# EasyEDA Pro project ProPrj_Solar MPPT Charger v6_2026-05-25.epro

# Schematic Solar Converter
Board Name: Solar Converter; Create Date: 2025-08-21; Page Name: Solar Converter; Project Name: Solar MPPT Charger v6; Schematic Name: Solar Converter; Update Date: 2025-08-22; Add into BOM: yes; Company: Your Company; Convert to PCB: yes; Date: 2020-07-08; Draw By: iqasi096; REV: 1.0; Sheet: 1/1
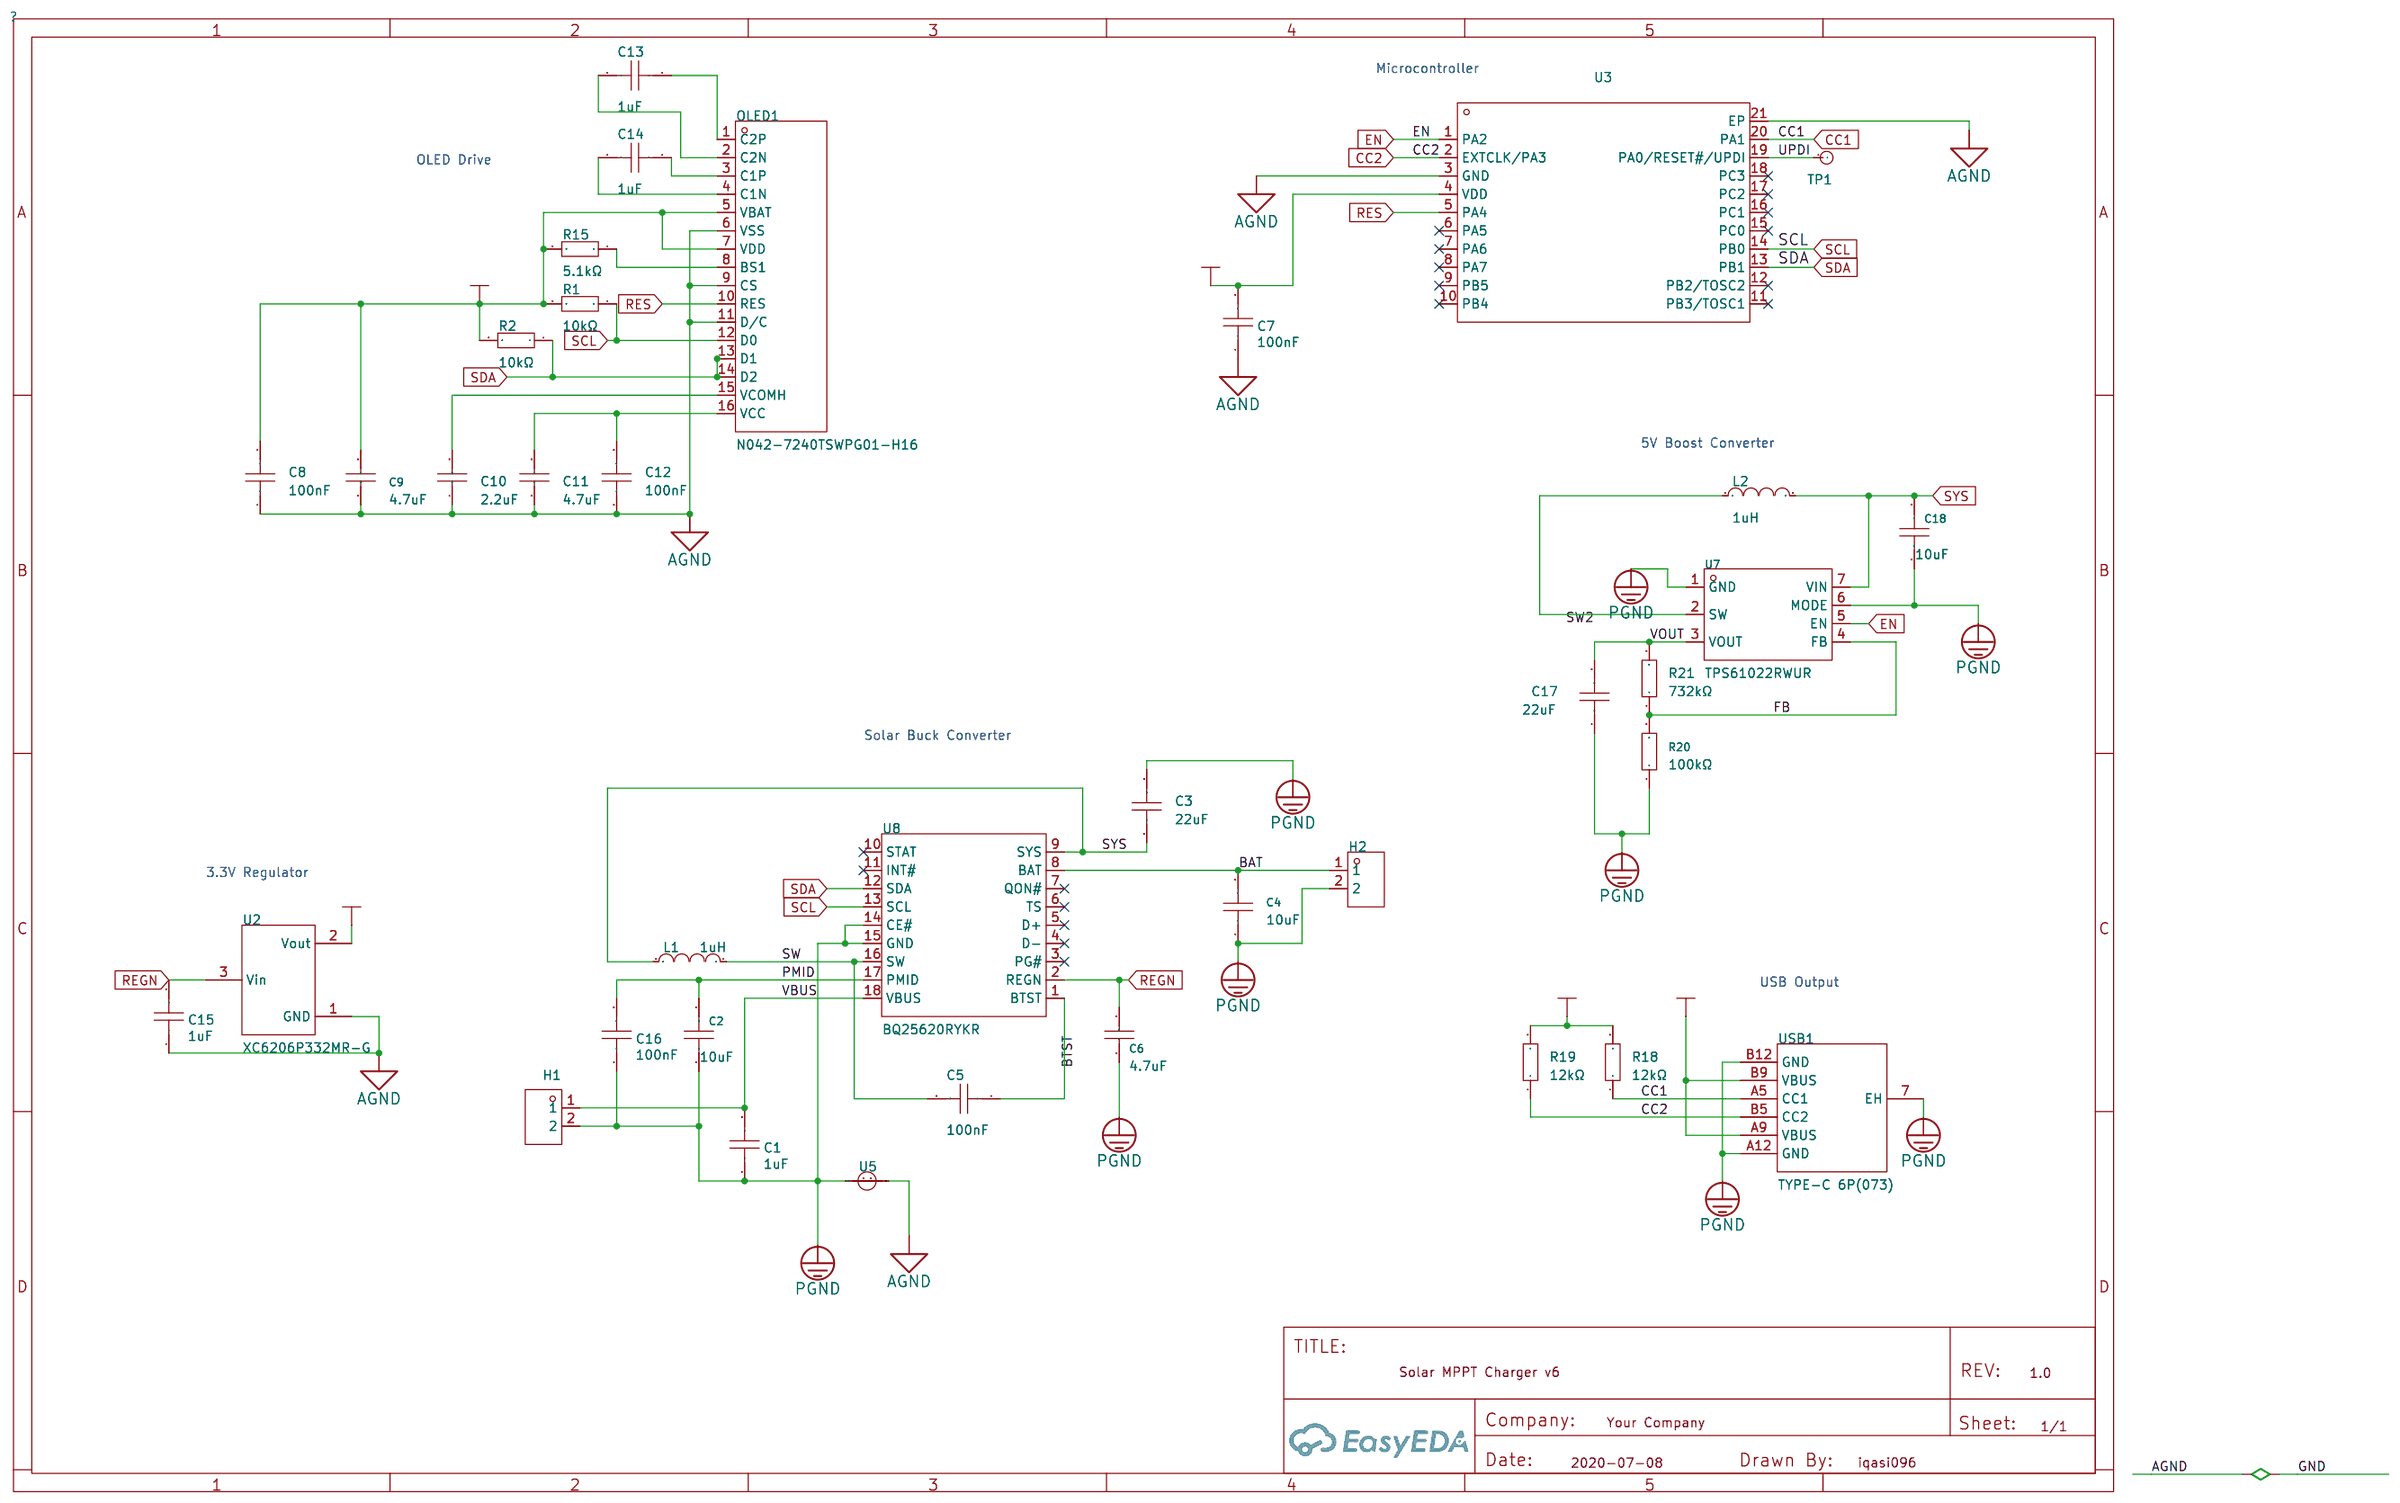
[diagram p0: schematic sheet]

## Parts
C1  1uF  [C0402]
C2  10uF  [C0603]
C3  22uF  [C0805]
C4  10uF  [C0603]
C5  100nF  [C0402]
C6  4.7uF  [C0402]
C7  100nF  [C0402]
C8  100nF  [C0402]
C9  4.7uF  [C0402]
C10  2.2uF  [C0603]
C11  4.7uF  [C0603]
C12  100nF  [C0402]
C13  1uF  [C0402]
C14  1uF  [C0402]
C15  1uF  [C0402]
C16  100nF  [C0402]
C17  22uF  [C0805]
C18  10uF  [C0603]
H1  SIP2-2.54MM双排针  [footprint_31f8]
H2  SIP2-2.54MM双排针  [footprint_31f8]
L1  1uH  [IND-SMD_L5.4-W5.2_SUMIDA_0530CDMCCDS]
L2  1uH  [IND-SMD_L5.4-W5.2_SUMIDA_0530CDMCCDS]
OLED1  N042-7240TSWPG01-H16  [OLED-SMD_L23.0-W12.0_N042-7240TSWPG01-H16]
R1  10kΩ  [R0402]
R2  10kΩ  [R0402]
R15  5.1kΩ  [R0402]
R18  12kΩ  [R0402]
R19  12kΩ  [R0402]
R20  100kΩ  [R0402]
R21  732kΩ  [R0402]
TP1  TESTPOIN-SMD-Ø1.2MM  [footprint_b741]
U2  XC6206P332MR-G  [SOT-23-3_L2.9-W1.6-P1.90-LS2.8-BR]
U3  ATTINY1616-MNR  [footprint_6c4b]
U5  -  [short_keith]  (no BOM)
U7  TPS61022RWUR  [VQFN-7_L2.0-W2.0-P0.55-TL_RWU]
U8  BQ25620RYKR  [WQFN-18_L3.0-W2.5-P0.40-TL]
USB1  TYPE-C 6P(073)  [TYPE-C-SMD_TYPE-C-6P-073]

## Library data of the parts
C1 C13-C15 = CL05A105KA5NQNC: Capacitance: Tolerance:±10% Tolerance:±10% Voltage Rated: Temperature Coefficient:; LCSC Part Name: 1uF ±10% 25V; Supplier Part: C52923; Manufacturer: SAMSUNG(三星); Supplier Footprint: 0402; JLCPCB Part Class: Basic Part; Datasheet: https://atta.szlcsc.com/upload/public/pdf/source/20160218/1457707763339.pdf; Supplier: LCSC; Tolerance: ±10%
C2 C4 C18 = CL10A106MA8NRNC: Capacitance: Tolerance:±20% Tolerance:±20% Voltage Rated: Temperature Coefficient:; LCSC Part Name: 10uF ±20% 25V; Supplier Part: C96446; Manufacturer: SAMSUNG(三星); Supplier Footprint: 0603; JLCPCB Part Class: Basic Part; Datasheet: https://atta.szlcsc.com/upload/public/pdf/source/20160218/1457707763339.pdf; Supplier: LCSC; Tolerance: ±20%
C3 C17 = CL21A226MAQNNNE: Capacitance: Tolerance:±20% Tolerance:±20% Voltage Rated: Temperature Coefficient:; LCSC Part Name: 22uF ±20% 25V; Supplier Part: C45783; Manufacturer: SAMSUNG(三星); Supplier Footprint: 0805; JLCPCB Part Class: Basic Part; Datasheet: https://atta.szlcsc.com/upload/public/pdf/source/20160218/1457707763339.pdf; Supplier: LCSC; Tolerance: ±20%
C5 = CL05B104KO5NNNC: Capacitance: Tolerance:±10% Tolerance:±10% Voltage Rated: Temperature Coefficient:; LCSC Part Name: 100nF ±10% 16V; Supplier Part: C1525; Manufacturer: SAMSUNG(三星); Supplier Footprint: 0402; JLCPCB Part Class: Basic Part; Datasheet: https://atta.szlcsc.com/upload/public/pdf/source/20160218/1457707763339.pdf; Supplier: LCSC; Tolerance: ±10%
C6 C9 = CL05A475MP5NRNC: Capacitance: Tolerance:±20% Tolerance:±20% Voltage Rated: Temperature Coefficient:; LCSC Part Name: 4.7uF ±20% 10V; Supplier Part: C23733; Manufacturer: SAMSUNG(三星); Supplier Footprint: 0402; JLCPCB Part Class: Basic Part; Datasheet: https://atta.szlcsc.com/upload/public/pdf/source/20160218/1457707763339.pdf; Supplier: LCSC; Tolerance: ±20%
C7 C8 C12 C16 = CL05B104KB54PNC: Capacitance: Tolerance:±10% Tolerance:±10% Voltage Rated: Temperature Coefficient:; LCSC Part Name: 100nF ±10% 50V; Supplier Part: C307331; Manufacturer: SAMSUNG(三星); Supplier Footprint: 0402; JLCPCB Part Class: Basic Part; Datasheet: https://atta.szlcsc.com/upload/public/pdf/source/20160218/1457707763339.pdf; Supplier: LCSC; Tolerance: ±10%
C10 = CL10A225KO8NNNC: Capacitance: Tolerance:±10% Tolerance:±10% Voltage Rated: Temperature Coefficient:; LCSC Part Name: 2.2uF ±10% 16V; Supplier Part: C23630; Manufacturer: SAMSUNG(三星); Supplier Footprint: 0603; JLCPCB Part Class: Basic Part; Datasheet: https://atta.szlcsc.com/upload/public/pdf/source/20160218/1457707763339.pdf; Supplier: LCSC; Tolerance: ±10%
C11 = CL10A475KO8NNNC: Capacitance: Tolerance:±10% Tolerance:±10% Voltage Rated: Temperature Coefficient:; LCSC Part Name: 4.7uF ±10% 16V; Supplier Part: C19666; Manufacturer: SAMSUNG(三星); Supplier Footprint: 0603; JLCPCB Part Class: Basic Part; Datasheet: https://atta.szlcsc.com/upload/public/pdf/source/20160218/1457707763339.pdf; Supplier: LCSC; Tolerance: ±10%
H1 H2 = SIP2-2.54MM双排针: Supplier: LCSC; Supplier Part: C9900003705; Manufacturer: null; Manufacturer Part: SIP2-2.54mm双排针; JLCPCB Part Class: Extended Part
L1 L2 = 0530CDMCCDS-1R0MC: Inductance: Tolerance:±20% Tolerance:±20% Rated Current: Saturation Current (Isat):12A DC Resistance (DCR): Type:- Ratings:-; LCSC Part Name: 1uH ±20% 12A; Supplier Part: C2453584; Manufacturer: Sumida(胜美达); Supplier Footprint: SMD,5.4x5.2mm; JLCPCB Part Class: Extended Part; Datasheet: https://atta.szlcsc.com/upload/public/pdf/source/20200609/C596466_5BCDC523DFFDD55220635ED057F3408C.pdf; Supplier: LCSC; Tolerance: ±20%; Saturation Current (Isat): 12A
OLED1 = N042-7240TSWPG01-H16: Main Control Chip:SSD1315 Interface Type:I2C Size:0.42 Pixel Resolution:72x40 Operating Temperature:-40℃~+85℃ Operating Temperature:-40℃~+85℃; LCSC Part Name: 0.42寸 白光 72x40像素分辨率 16PIN; Supplier Part: C2890602; Manufacturer: Newvision(新智景); JLCPCB Part Class: Extended Part; Datasheet: https://atta.szlcsc.com/upload/public/pdf/source/20220616/8E4FF058E99944D2E326A1AA19D8CE74.pdf; Supplier: LCSC; Main Control Chip: SSD1315; Interface Type: I2C; Size: 0.42; Pixel Resolution: 72x40; Operating Temperature: -40℃~+85℃
R1 R2 = 0402WGF1002TCE: Type:Thick Film Resistors Resistance:10kΩ Tolerance:±1% Tolerance:±1% Power(Watts): Overload Voltage (Max): Temperature Coefficient:±100ppm/℃ Temperature Coefficient:±100ppm/℃ Operating Temperature Range:-55℃~+155℃ Operating Temperature Range:-55℃~+155℃; LCSC Part Name: 10kΩ ±1% 62.5mW 厚膜电阻; Supplier Part: C25744; Manufacturer: UNI-ROYAL(厚声); Supplier Footprint: 0402; JLCPCB Part Class: Basic Part; Datasheet: https://atta.szlcsc.com/upload/public/pdf/source/20200306/C422600_1E6D84923E4A46A82E41ADD87F860B5C.pdf; Supplier: LCSC; Type: Thick Film Resistors; Tolerance: ±1%; Temperature Coefficient: ±100ppm/℃; Operating Temperature Range: -55℃~+155℃
R15 = 0402WGF5101TCE: Type:Thick Film Resistors Resistance:5.1kΩ Tolerance:±1% Tolerance:±1% Power(Watts): Overload Voltage (Max): Temperature Coefficient:±100ppm/℃ Temperature Coefficient:±100ppm/℃ Operating Temperature Range:-55℃~+155℃ Operating Temperature Range:-55℃~+155℃; LCSC Part Name: 5.1kΩ ±1% 62.5mW 厚膜电阻; Supplier Part: C25905; Manufacturer: UNI-ROYAL(厚声); Supplier Footprint: 0402; JLCPCB Part Class: Basic Part; Datasheet: https://atta.szlcsc.com/upload/public/pdf/source/20200306/C422600_1E6D84923E4A46A82E41ADD87F860B5C.pdf; Supplier: LCSC; Type: Thick Film Resistors; Tolerance: ±1%; Temperature Coefficient: ±100ppm/℃; Operating Temperature Range: -55℃~+155℃
R18 R19 = 0402WGF1202TCE: Type:Thick Film Resistor Resistance:12kΩ Tolerance:±1% Tolerance:±1% Power(Watts):62.5mW Voltage-Supply(Max):50V Temperature Coefficient:±100ppm/℃ Temperature Coefficient:±100ppm/℃ Operating Temperature:-55℃~+155℃ Operating Temperature:-55℃~+155℃; LCSC Part Name: 12kΩ ±1% 62.5mW 厚膜电阻; Supplier Part: C25752; Manufacturer: UNI-ROYAL(厚声); Supplier Footprint: 0402; JLCPCB Part Class: Basic Part; Datasheet: https://item.szlcsc.com/datasheet/0402WGF1202TCE/26495.html; Supplier: LCSC; Type: Thick Film Resistor; Tolerance: ±1%; Power(Watts): 62.5mW; Voltage-Supply(Max): 50V; Temperature Coefficient: ±100ppm/℃; Operating Temperature: -55℃~+155℃
R20 = 0402WGF1003TCE: Type:Thick Film Resistors Resistance:100kΩ Tolerance:±1% Tolerance:±1% Power(Watts): Overload Voltage (Max): Temperature Coefficient:±100ppm/℃ Temperature Coefficient:±100ppm/℃ Operating Temperature Range:-55℃~+155℃ Operating Temperature Range:-55℃~+155℃; LCSC Part Name: 100kΩ ±1% 62.5mW 厚膜电阻; Supplier Part: C25741; Manufacturer: UNI-ROYAL(厚声); Supplier Footprint: 0402; JLCPCB Part Class: Basic Part; Datasheet: https://atta.szlcsc.com/upload/public/pdf/source/20200306/C422600_1E6D84923E4A46A82E41ADD87F860B5C.pdf; Supplier: LCSC; Type: Thick Film Resistors; Tolerance: ±1%; Temperature Coefficient: ±100ppm/℃; Operating Temperature Range: -55℃~+155℃
R21 = AC0402FR-07732KL: Type:Thick Film Resistor Resistance:732kΩ Tolerance:±1% Tolerance:±1% Power(Watts):62.5mW Voltage-Supply(Max):50V Temperature Coefficient:±100ppm/℃ Temperature Coefficient:±100ppm/℃ Operating Temperature:-55℃~+155℃ Operating Temperature:-55℃~+155℃; LCSC Part Name: 厚膜电阻 732kΩ ±1% 62.5mW; Supplier Part: C227216; Manufacturer: YAGEO(国巨); Supplier Footprint: 0402; JLCPCB Part Class: Extended Part; Datasheet: https://atta.szlcsc.com/upload/public/pdf/source/20241120/4D446B3946E6DC27047BD586A1D384B4.pdf; Supplier: LCSC; Type: Thick Film Resistor; Tolerance: ±1%; Power(Watts): 62.5mW; Voltage-Supply(Max): 50V; Temperature Coefficient: ±100ppm/℃; Operating Temperature: -55℃~+155℃
TP1 = TESTPOIN-SMD-Ø1.2MM
U2 = XC6206P332MR-G_C5446: Output Type: Maximum Input Voltage:6V Output Voltage:3.3V Output Voltage:3.3V MAX Output Current:200mA Power Supply Rejection Ratio (PSRR):- Dropout Voltage:680mV@(100mA) Output Polarity:Positive electrode Number of Outputs:1; LCSC Part Name: 输入6V 输出3.3V 200mA; Supplier Part: C5446; Manufacturer: TOREX(特瑞仕); Supplier Footprint: SOT-23-3L; JLCPCB Part Class: Basic Part; Datasheet: https://atta.szlcsc.com/upload/public/pdf/source/20130823/1457706639850.pdf; Supplier: LCSC; Maximum Input Voltage: 6V; Output Voltage: 3.3V; MAX Output Current: 200mA; Dropout Voltage: 680mV@(100mA); Output Polarity: Positive electrode; Number of Outputs: 1
U3 = ATTINY1616-MNR: CPU Core:AVR Program Storage Size:16KB RAM Size:2KB GPIO Ports Number:18 Operating Voltage Range:1.8V~5.5V Operating Voltage Range:1.8V~5.5V CPU Maximum Speed:20MHz Program Memory Type:FLASH Operating Temperature Range:-40℃~+105℃ Operating Temperature Ran; Supplier Part: C507118; Manufacturer: MICROCHIP(美国微芯); Supplier Footprint: QFN-20-EP(3x3); JLCPCB Part Class: Extended Part; Datasheet: https://atta.szlcsc.com/upload/public/pdf/source/20200402/C507118_C9B3D13493A25E1DA778A35EE1D23665.pdf; Supplier: LCSC; CPU Core: AVR; Program Storage Size: 16KB; RAM Size: 2KB; GPIO Ports Number: 18; Operating Voltage Range: 1.8V~5.5V; CPU Maximum Speed: 20MHz; Program Memory Type: FLASH; Operating Temperature Range: -40℃~+105℃; ADC (Bit): 10bit; DAC (Bit): 8bit; Peripheral/Function: WDT；PWM; Watchdog: 有; Infrared Data Association: 有; Low-Voltage Detect: 有; Internal Oscillator: 有
U5 = short_small
U7 = TPS61022RWUR: Function:Boost Output Type:Adjustable Voltage - Supply:500mV~5.5V Voltage - Supply:500mV~5.5V Output Voltage:2.2V~5.5V Output Voltage:2.2V~5.5V Output Current:- Frequency - Switching:1MHz；600kHz Frequency - Switching:1MHz；600kHz Operating Temperature:-40℃; LCSC Part Name: 具有0.5V超低输入电压的升压转换器; Supplier Part: C915088; Manufacturer: TI(德州仪器); Supplier Footprint: VQFN-7(2x2); JLCPCB Part Class: Extended Part; Datasheet: https://www.ti.com/cn/lit/gpn/tps61022; Supplier: LCSC; Function: Boost; Output Type: Adjustable; Voltage - Supply: 500mV~5.5V; Output Voltage: 2.2V~5.5V; Frequency - Switching: 1MHz；600kHz; Operating Temperature: -40℃~+125℃@(TJ); Synchronous Rectifier: Yes; Number of Outputs: 1; Topology: Boost; Switch tube (built-in/external): Built-In
U8 = BQ25620RYKR_C6164243: The Chip Type:Charging IC Voltage - Supply:3.9V~18V Voltage - Supply:3.9V~18V Charge Current - Max:3.5A Charging Saturation Voltage:- Type of Battery:Lithium Battery Number of Cells:1 Number of Cells:1 Operating Temperature:-40℃~+85℃ Operating Temperature; LCSC Part Name: 支持I2C控制，具备NVDC电源路径管理和OTG输出功能的充电器; Supplier Part: C6164243; Manufacturer: TI(德州仪器); Supplier Footprint: WQFN-18; JLCPCB Part Class: Extended Part; Datasheet: https://atta.szlcsc.com/upload/public/pdf/source/20230606/C8A5575A0EBA51318CA858400E478599.pdf; Supplier: LCSC; The Chip Type: Charging IC; Voltage - Supply: 3.9V~18V; Charge Current - Max: 3.5A; Type of Battery: Lithium Battery; Number of Cells: 1; Operating Temperature: -40℃~+85℃; Battery Temperature Detection: Support; Supply Current (Iq): 1.5uA
USB1 = TYPE-C 6P(073): Connector Type:Type-C Standard:USB 3.1 Gender:Female Mounting Style:Horizontal attachment Number of Contacts:6P Number of Ports:1 Current Rating - Power (Max):3A Operating Temperature Range:-25℃~+85℃ Operating Temperature Range:-25℃~+85℃ Rated Voltage (Ma; LCSC Part Name: Type-C 母 卧贴; Supplier Part: C668623; Manufacturer: SHOU HAN(首韩); Supplier Footprint: SMD; JLCPCB Part Class: Extended Part; Datasheet: https://atta.szlcsc.com/upload/public/pdf/source/20200618/C668623_A4B260DED7AC1949BAC6AE39E9F4CD80.pdf; Supplier: LCSC; Connector Type: Type-C; Standard: USB 3.1; Gender: Female; Mounting Style: Horizontal attachment; Number of Contacts: 6P; Number of Ports: 1; Current Rating - Power (Max): 3A; Operating Temperature Range: -25℃~+85℃; Rated Voltage (Max): 5V; Connect-Disconnect Life: 10,000 times; Core Colour: Black

## Nets
AGND: C7.1 C8.1 C9.1 C10.1 C11.1 C12.1 C15.1 OLED1.6(VSS) OLED1.9(CS) OLED1.11(D/C) U2.1(GND) U3.3(GND) U3.21(EP) U5.2
PGND: C1.1 C2.1 C3.2 C4.1 C6.1 C16.1 C17.1 C18.1 H1.2 H2.2 R20.1 U5.1 U7.1(GND) U7.6(MODE) U8.14(CE#) U8.15(GND) USB1.7(EH) USB1.A12(GND) USB1.B12(GND)
VBUS: C1.2 H1.1 U8.18(VBUS)
VDD: C7.2 C8.2 C9.2 OLED1.5(VBAT) OLED1.7(VDD) R1.2 R2.2 R15.2 R18.2 R19.2 U2.2(Vout) U3.4(VDD)
BAT: C4.2 H2.1 U8.8(BAT)
BTST: C5.1 U8.1(BTST)
CC1: R18.1 U3.20(PA1) USB1.A5(CC1)
CC2: R19.1 U3.2(EXTCLK/PA3) USB1.B5(CC2)
EN: U3.1(PA2) U7.5(EN)
FB: R20.2 R21.1 U7.4(FB)
PMID: C2.2 C16.2 U8.17(PMID)
REGN: C6.2 C15.2 U2.3(Vin) U8.2(REGN)
RES: OLED1.10(RES) U3.5(PA4)
SCL: OLED1.12(D0) R1.1 U3.14(PB0) U8.13(SCL)
SDA: OLED1.13(D1) OLED1.14(D2) R2.1 U3.13(PB1) U8.12(SDA)
SW: C5.2 L1.2 U8.16(SW)
SW2: L2.1 U7.2(SW)
SYS: C3.1 C18.2 L1.1 L2.2 U7.7(VIN) U8.9(SYS)
UPDI: TP1.1 U3.19(PA0/RESET#/UPDI)
VOUT: C17.2 R21.2 U7.3(VOUT) USB1.A9(VBUS) USB1.B9(VBUS)
$1N11030: OLED1.8(BS1) R15.1
$1N11114: C14.2 OLED1.4(C1N)
$1N11119: C14.1 OLED1.3(C1P)
$1N11125: C13.2 OLED1.2(C2N)
$1N11133: C13.1 OLED1.1(C2P)
$1N11196: C11.2 C12.2 OLED1.16(VCC)
$1N11213: C10.2 OLED1.15(VCOMH)

Not connected (* = marked no-connect by the designer): U3 6(PA5)* 7(PA6)* 8(PA7)* 9(PB5)* 10(PB4)* 11(PB3/TOSC1)* 12(PB2/TOSC2)* 15(PC0)* 16(PC1)* 17(PC2)* 18(PC3)*; U8 3(PG#)* 4(D-)* 5(D+)* 6(TS)* 7(QON#)* 10(STAT)* 11(INT#)*

## Notes on the sheet
- Microcontroller
- OLED Drive
- 5V Boost Converter
- Solar Buck Converter
- 3.3V Regulator
- USB Output

# Board Solar Converter
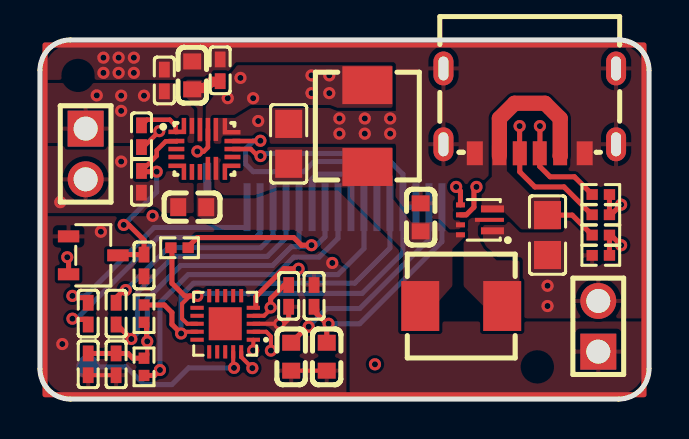
[diagram p1: board, top side]
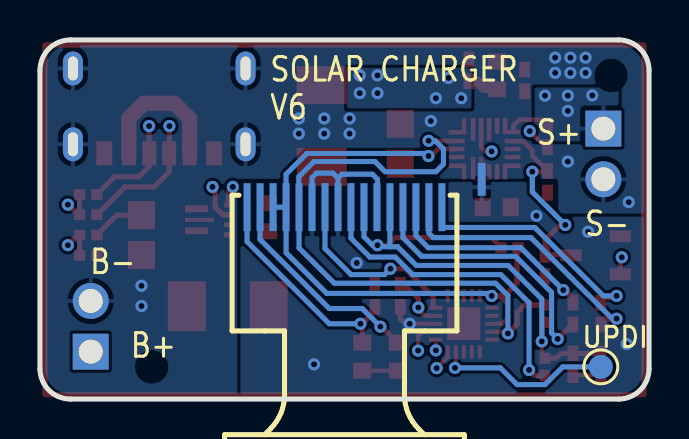
[diagram p2: board, bottom side, seen from below]

Outline 30.48 x 18 mm; copper layers: Top Layer, Inner1, Inner2, Bottom Layer. Coordinates in mm from the lower left corner of the outline.
Outline path: 0,16.47 0,1.52 arc(0.45,0.45) 1.52,0 28.96,0 arc(30.03,0.45) 30.48,1.52 30.48,16.47 arc(30.03,17.55) 28.96,18 1.52,18 arc(0.45,17.55) 0,16.47
Stack: Top Layer 0.035mm 外层铜厚1oz / Dielectric1 0.28mm 7628 RC49% 8.6mil / Inner1 0.035mm 内层铜厚 / Dielectric2 0.28mm 1.1mm H/HOZ 含铜 / Inner2 0.035mm 内层铜厚 / Dielectric3 0.28mm 7628 RC49% 8.6mil / Bottom Layer 0.035mm 外层铜厚1oz

## Design rules (mm)
template: User Custom Config
spacing Default (default): track to track 0.152, other pairs 0 to 0.152
spacing Slim: track to track 0.152, other pairs 0 to 0.152
track width Default (default): min 0.127, default 0.127, max 25.4
track width Slim: min 0.127, default 0.127, max 25.4
differential pair differentialPair (default): width min 0.127, default 0.254, max 2.54; gap min 0.152, default 0.152
via Default (default): diameter min 0.305, default 0.305, max 100.025; hole min 0.152, default 0.152, max 59.995
via Slim: diameter min 0.305, default 0.305, max 100.025; hole min 0.152, default 0.152, max 59.995
pour e2470 uses CopperRegion

## Placement (name value [footprint] x y rotation side)
C1  1uF  [C0402]  6.22 15.97 270 top
C2  10uF  [C0603]  7.62 16.22 270 top
C3  22uF  [C0805]  12.45 12.79 90 top
C4  10uF  [C0603]  7.62 9.62 0 top
C5  100nF  [C0402]  5.08 13.17 270 top
C6  4.7uF  [C0402]  5.08 10.89 90 top
C7  100nF  [C0402]  12.45 5.17 90 top
C8  100nF  [C0402]  3.81 1.74 90 top
C9  4.7uF  [C0402]  2.41 1.74 90 top
C10  2.2uF  [C0603]  12.57 2.12 90 top
C11  4.7uF  [C0603]  14.35 2.12 90 top
C12  100nF  [C0402]  13.72 5.17 270 top
C13  1uF  [C0402]  2.41 4.28 270 top
C14  1uF  [C0402]  3.81 4.28 270 top
C15  1uF  [C0402]  5.21 6.7 90 top
C16  100nF  [C0402]  9.02 16.47 270 top
C17  22uF  [C0805]  25.4 8.22 90 top
C18  10uF  [C0603]  19.05 9.11 270 top
H1  SIP2-2.54MM双排针  [footprint_31f8]  2.29 12.28 180 top
H2  SIP2-2.54MM双排针  [footprint_31f8]  27.94 3.65 0 top
L1  1uH  [IND-SMD_L5.4-W5.2_SUMIDA_0530CDMCCDS]  16.38 13.68 90 top
L2  1uH  [IND-SMD_L5.4-W5.2_SUMIDA_0530CDMCCDS]  21.08 4.66 180 top
OLED1  N042-7240TSWPG01-H16  [OLED-SMD_L23.0-W12.0_N042-7240TSWPG01-H16]  15.24 9.62 0 bottom
R13  10kΩ  [R0402]  5.21 4.28 270 top
R14  10kΩ  [R0402]  6.99 7.58 0 top
R15  5.1kΩ  [R0402]  5.21 1.62 90 top
R18  12kΩ  [R0402]  28.07 10.25 0 top
R19  12kΩ  [R0402]  28.07 9.24 0 top
R20  100kΩ  [R0402]  28.07 7.2 0 top
R21  732kΩ  [R0402]  28.07 8.22 180 top
U2  XC6206P332MR-G  [SOT-23-3_L2.9-W1.6-P1.90-LS2.8-BR]  2.67 7.2 180 top
U3  ATTINY1616-MNR  [footprint_6c4b]  9.27 3.77 90 top
U5  -  [short_keith]  8.37 11.01 270 bottom
U7  TPS61022RWUR  [VQFN-7_L2.0-W2.0-P0.55-TL_RWU]  21.84 8.98 180 top
U8  BQ25620RYKR  [WQFN-18_L3.0-W2.5-P0.40-TL]  8.23 12.54 0 top
UPDI  TESTPOIN-SMD-Ø1.2MM  [footprint_b741]  2.41 1.62 180 bottom
USB1  TYPE-C 6P(073)  [TYPE-C-SMD_TYPE-C-6P-073]  24.51 14.44 180 top

## Footprints (pads in the part's own frame, mm; a bottom-side part is the same pattern mirrored in y, then rotated)
C0402
  rect 0.79x0.54 smd: 1(-0.545,0) 2(0.545,0)
C0603
  rect 0.8x0.9 smd: 1(-0.7,0) 2(0.7,0)
C0805
  rect 1.41x1.35 smd: 1(-1,0) 2(1,0)
footprint_6c4b
  rect 0.2x0.665 smd: 1(-0.8,-1.407) 2(-0.4,-1.407) 3(0,-1.407) 4(0.4,-1.407) 5(0.8,-1.407) 11(0.8,1.407) 12(0.4,1.407) 13(0,1.407) 14(-0.4,1.407) 15(-0.8,1.407)
  rect 0.665x0.2 smd: 6(1.407,-0.8) 7(1.407,-0.4) 8(1.407,0) 9(1.407,0.4) 10(1.407,0.8) 16(-1.407,0.8) 17(-1.407,0.4) 18(-1.407,0) 19(-1.407,-0.4) 20(-1.407,-0.8)
  rect 1.65x1.65 smd: 21(0,0)
footprint_31f8
  rect 1.8x1.8 hole 1.2: 1(0,-1.27)
  round 1.8 hole 1.2: 2(0,1.27)
footprint_b741
  round 1.2 smd: 1(0,0)
IND-SMD_L5.4-W5.2_SUMIDA_0530CDMCCDS
  rect 1.9x2.5 smd: 1(-2.05,0) 2(2.05,0)
OLED-SMD_L23.0-W12.0_N042-7240TSWPG01-H16
  rect 0.35x2.4 smd: 1(-4.875,0) 2(-4.225,0) 3(-3.575,0) 4(-2.925,0) 5(-2.275,0) 6(-1.625,0) 7(-0.975,0) 8(-0.325,0) 9(0.325,0) 10(0.975,0) 11(1.625,0) 12(2.275,0) 13(2.925,0) 14(3.575,0) 15(4.225,0) 16(4.875,0)
R0402
  rect 0.566x0.54 smd: 1(-0.433,0) 2(0.433,0)
short_keith
  rect 0.85x0.4 smd: 1(-0.4,0) 2(0.4,0)
SOT-23-3_L2.9-W1.6-P1.90-LS2.8-BR
  rect 1.07x0.6 smd: 1(1.235,-0.95) 2(1.235,0.95) 3(-1.235,0)
TYPE-C-SMD_TYPE-C-6P-073
  oval 1x1.7 hole 0.5x1.2: 7(-4.32,1.675) 7(-4.32,-2.125) 7(4.32,1.675) 7(4.32,-2.125)
  rect 0.7x1.2 smd: A5(-0.5,2.125) A9(1.52,2.125) B5(0.5,2.125) B9(-1.52,2.125)
  rect 0.8x1.2 smd: A12(2.75,2.125) B12(-2.75,2.125)
VQFN-7_L2.0-W2.0-P0.55-TL_RWU
  rect 1.15x0.35 smd: 1(-0.8,0.55) 3(-0.8,-0.55)
  rect 1.45x0.2 smd: 2(-0.65,0)
  rect 0.45x0.25 smd: 4(0.8,-0.75) 5(0.8,-0.25) 6(0.8,0.25) 7(0.8,0.75)
WQFN-18_L3.0-W2.5-P0.40-TL
  custom 0.889x0.814 smd: 1(-1.357,0.85) 5(-1.357,-0.85) 10(1.357,-0.85) 14(1.357,0.836)
  rect 0.795x0.224 smd: 2(-1.403,0.393) 3(-1.403,-0.007) 4(-1.403,-0.407) 11(1.403,-0.407) 12(1.403,-0.007) 13(1.403,0.393)
  rect 0.224x0.795 smd: 6(-0.625,-1.153) 7(-0.225,-1.153) 18(-0.625,1.153)
  rect 0.224x1.15 smd: 8(0.175,-0.976) 9(0.575,-0.976) 15(0.575,0.976) 16(0.175,0.977) 17(-0.225,0.977)

## Nets
As in the schematic, except:
VDD: C7.2 C8.2 C9.2 OLED1.5 OLED1.7 R13.2 R14.2 R15.2 R18.2 R19.2 U2.2 U3.4
SCL: OLED1.12 R13.1 U3.14 U8.13
SDA: OLED1.13 OLED1.14 R14.1 U3.13 U8.12
UPDI: U3.19 UPDI.1

Pads without a net: U3 6 7 8 9 10 11 12 15 16 17 18; U8 3 4 5 6 7 10 11

## Via types
v1: diameter 0.61, hole 0.305, Top Layer to Bottom Layer, 64 vias

## Routing (per net, layer and track width the routed paths; a pad name or vN(x,y) marks a point on that pad's centre or on a via; arc(x,y) is an arc through that point)
AGND: length 13.6
  Top Layer w0.203: C10.1 C11.1 ; v1(11.98,3.77) U3.3 ; C9.1 C8.1
  Top Layer w0.254: v1(11.98,3.77) 12.19,3.77 12.45,4.03 C7.1
  Bottom Layer w0.254: OLED1.6 13.59,9.64 13.59,11.01 13.84,11.27 15.37,11.27 15.56,11.07 ; 15.56,11.07 15.82,11.32 16.64,11.32 16.87,11.1 OLED1.11 ; 15.56,11.07 OLED1.9
  vias: v1(1.12,2.76) v1(3.05,8.39) v1(5.64,9.18) v1(14.63,6.82) v1(16.76,1.74)
PGND:
  vias: v1(1.02,9.87) v1(3.18,17.11) v1(3.18,16.35) v1(3.94,17.11) v1(3.94,16.35) v1(4.06,11.9) v1(4.7,17.11) v1(4.7,16.35) v1(10.92,13.93) v1(14.99,14.06) v1(14.99,13.3) v1(16.26,14.06) v1(16.26,13.3) v1(17.53,14.06) v1(17.53,13.3) v1(25.4,5.68) v1(25.4,4.66)
VBUS:
  vias: v1(2.84,15.22) v1(4.06,15.2) v1(4.06,14.44) v1(5.21,15.2)
VDD: length 45.1
  Top Layer w0.203: U3.4 11.21,4.17 11.54,4.5 v1(11.54,4.59) ; v1(5.37,2.89) 5.37,2.21 R15.2
  Top Layer w0.254: v1(1.37,7.11) 1.43,7.04 U2.2 ; C9.2 C8.2 4.41,2.29 4.65,2.05 R15.2 ; R18.2 R19.2 28.57,9.24 v1(29.08,9.74) ; R14.2 7.42,7.64 7.87,8.09 12.7,8.09 13.08,7.71 v1(13.59,7.71) ; v1(5.37,2.89) 5.33,2.93 5.33,3.85 ; C7.2 12.23,5.72 11.54,5.03 v1(11.54,4.59)
  Inner2 w0.254: 19.81,1.74 27.81,9.74 v1(29.08,9.74)
  Bottom Layer w0.254: 12.97,7.64 12.58,7.64 11.64,6.7 7.05,6.7 5.37,5.02 v1(5.37,2.89) ; 12.97,7.64 12.97,9.61 OLED1.5 ; 12.97,7.64 13.51,7.64 v1(13.59,7.71) 13.84,7.71 14.26,8.13 14.26,9.62
BTST: length 2.4
  Top Layer w0.229: 6.9,13.39 6.79,13.39 6.79,13.71 6.5,14 5.36,14 C5.1
CC1: length 29.2
  Top Layer w0.203: U3.20 10.07,2.11 v1(10.63,1.55)
  Top Layer w0.254: v1(25.02,13.68) 25.02,12.2 25.01,12.19 25.01,11.66 25.53,11.14 26.75,11.14 R18.1
  Inner2 w0.254: v1(25.02,13.68) 25.02,7.71 19.94,2.63 16.51,2.63 15.49,1.62 10.69,1.62 v1(10.63,1.55)
CC2: length 29.2
  Top Layer w0.203: v1(11.56,2.43) 11.56,3.14 11.32,3.37 U3.2
  Top Layer w0.254: R19.1 27.62,9.24 26.22,10.63 24.76,10.63 24.01,11.39 24.01,12.19 24,12.2 v1(24,13.68)
  Inner2 w0.254: v1(24,13.68) 24,7.52 19.75,3.27 16.13,3.27 15.29,2.43 v1(11.56,2.43)
EN: length 19.6
  Top Layer w0.203: v1(10.67,2.44) 10.68,2.45 U3.1
  Top Layer w0.254: v1(21.84,10.63) 21.72,10.51 21.72,9.62 21.33,9.23 U7.5
  Inner2 w0.254: v1(21.84,10.63) 21.84,6.19 19.43,3.77 15.75,3.77 14.99,3.01 11.24,3.01 v1(10.67,2.44)
FB: length 12.3
  Top Layer w0.254: v1(20.83,10.63) 21.04,10.42 U7.4 ; v1(29.08,7.71) 28.57,8.22 R21.1 R20.2
  Inner1 w0.254: v1(29.08,7.71) 27.18,9.62 21.84,9.62 v1(20.83,10.63)
PMID: length 1.6
  Top Layer w0.508: C2.2 7.69,15.59 8.25,15.59 8.57,15.9 8.86,15.9 8.89,15.93 C16.2
REGN: length 10.1
  Top Layer w0.229: 6.85,12.93 6.84,12.92 6.3,12.92 5.84,12.46 5.84,12.19 C6.2
  Top Layer w0.254: C6.2 5.12,11.39 v1(5.84,11.39) ; v1(4.19,8.73) 4.44,8.73 5.21,7.97 C15.2 3.94,7.24 U2.3
  Bottom Layer w0.254: v1(5.84,11.39) 5.84,10.38 v1(4.19,8.73)
RES: length 9.3
  Top Layer w0.254: 10.8,4.61 10.8,5.13 12.2,6.53 v1(12.94,6.53)
  Bottom Layer w0.254: v1(12.94,6.53) 13.24,6.24 14.91,6.24 16.22,7.54 OLED1.10
SCL: length 31.5
  Top Layer w0.203: v1(7.06,3.29) 7.15,3.37 U3.14
  Top Layer w0.229: 9.66,12.93 11.02,12.93 v1(11.03,12.94)
  Top Layer w0.254: v1(7.06,3.29) 6.6,3.75 6.6,4.33 6.22,4.72 5.21,4.72
  Bottom Layer w0.254: v1(11.03,12.94) 10.69,12.94 10.29,12.54 10.29,11.78 10.67,11.39 13.21,11.39 13.72,11.9 16.76,11.9 17.53,11.14 17.53,9.63 OLED1.12 17.51,7.57 15.75,5.81 7.68,5.81 7.06,5.19 v1(7.06,3.29)
SDA: length 30.5
  Top Layer w0.203: 7.5,5.17 7.11,4.78 7.11,4.03 7.37,3.77 U3.13
  Top Layer w0.229: v1(11.04,12.18) 10.9,12.18 10.55,12.53 9.66,12.53
  Top Layer w0.254: 7.79,5.17 7.24,5.17 6.6,5.81 6.6,7.46 6.48,7.58 6.43,7.58
  Bottom Layer w0.254: 7.79,5.17 7.92,5.17 8.04,5.3 16.13,5.3 18.16,7.33 18.16,9.49 18.16,9.49 18.16,9.62 ; 18.16,9.62 18.16,11.26 17.12,12.31 11.17,12.31 v1(11.04,12.18) ; 18.16,9.62 OLED1.14
  vias: v1(7.87,5.17)
SW: length 5.1
  Top Layer w0.229: U8.16 8.4,12.62 8.2,12.41 v1(7.88,12.41) ; v1(5.97,13.43) 5.17,12.63 C5.2
  Inner2 w0.229: v1(7.88,12.41) 6.86,13.43 v1(5.97,13.43)
  vias: v1(9.4,15.08) v1(10.03,16.09) v1(10.67,15.08) v1(13.59,16.22) v1(13.59,15.33) v1(14.48,16.22) v1(14.48,15.33)
UPDI: length 8.8
  Top Layer w0.203: U3.19 9.67,1.6 v1(9.71,1.56)
  Bottom Layer w0.254: UPDI.1 4.32,1.62 5.21,0.73 6.6,0.73 7.44,1.56 v1(9.71,1.56)
VOUT: length 10.1
  Top Layer w0.254: C17.2 26.63,9.22 R21.2
  Top Layer w0.762: 22.99,12.19 22.99,14.07 23.75,14.82 25.27,14.82 26.03,14.06 26.03,12.19 26.03,12.19
$1N11030: length 16.1
  Top Layer w0.254: v1(6,1.46) 5.73,1.18 R15.1
  Bottom Layer w0.254: v1(6,1.46) 6,4.83 7.42,6.24 11.82,6.24 12.7,7.12 13.97,7.12 14.91,8.06 OLED1.8
$1N11114: length 13.9
  Top Layer w0.254: v1(4.57,3.01) 3.81,3.77 3.81,3.99
  Bottom Layer w0.254: v1(4.57,3.01) 4.88,3.32 4.88,5.35 6.68,7.15 11.38,7.15 12.31,8.09 OLED1.4
$1N11119: length 10.6
  Top Layer w0.254: 3.81,5.08 4.19,5.46 v1(4.29,5.46)
  Bottom Layer w0.254: v1(4.29,5.46) 6.41,7.58 11.05,7.58 11.66,8.2 11.66,9.62
$1N11125: length 13.5
  Top Layer w0.254: 2.41,3.99 1.66,3.99 v1(1.63,4.03)
  Bottom Layer w0.254: 1.55,4.03 1.68,3.9 1.72,3.9 5.91,8.09 10.79,8.09 11.01,8.31 OLED1.2
$1N11133: length 12
  Top Layer w0.254: 2.41,5.08 1.71,5.08 v1(1.62,5.17)
  Bottom Layer w0.254: v1(1.62,5.17) 2.29,5.17 5.72,8.6 10.37,8.6 OLED1.1
$1N11196: length 11.3
  Top Layer w0.254: C11.2 14.35,3.68 v1(14.44,3.77) 14.35,3.77 13.84,4.28 13.84,4.5 C12.2
  Bottom Layer w0.254: OLED1.16 20.12,7.89 16,3.77 v1(14.44,3.77)
$1N11213: length 10.7
  Top Layer w0.254: C10.2 13.38,3.63 v1(13.44,3.63)
  Bottom Layer w0.254: OLED1.15 19.47,8 16,4.54 14.35,4.54 v1(13.44,3.63)

## Copper pours and planes (outline as drawn; the poured copper is in the pictures)
AGND on Top Layer: 0,9.17 7.85,9.17 7.85,10.82 15.37,10.82 15.37,-0.04 0,-0.04
AGND on Bottom Layer: 0.13,9.14 4.7,9.14 4.7,10.89 20.45,10.89 20.45,-0.04 0.13,-0.04
AGND on Inner1: -0.12,9.24 7.88,9.24 7.88,10.86 20.58,10.86 20.58,-0.07 -0.12,-0.07
PGND on Top Layer: 0,18 30.48,18 30.48,-0.04 0,-0.04
PGND on Top Layer: 8.69,14.09 9.77,14.09 10.58,14.58 14.49,14.58 14.86,14.44 18.8,14.44 18.8,12.79 8.69,12.79
PGND on Bottom Layer: 0,18 30.48,18 30.48,0.09 0,0.09
PGND on Inner1: -0.13,18 30.48,18 30.48,-0.04 -0.13,-0.04
PGND on Inner2: 0,18 30.48,18 30.48,-0.04 0,-0.04
VBUS on Top Layer: 0,15.84 0,12.83 7.73,12.83 7.73,15.84
VBUS on Bottom Layer: 1.52,15.61 5.72,15.61 5.72,12.92 1.52,12.92
VDD on Inner2: 0.11,9.11 7.85,9.11 7.85,10.98 20.55,10.98 20.55,0.06 0.11,0.06
BAT on Top Layer: 14.86,10.51 17.97,7.46 17.97,3.89 30.25,3.89 30.25,0.33 15.49,0.33 15.49,6.58 12.7,8.48 9.18,8.48 7.85,9.17 7.84,11.93 11.8,11.93 11.8,11.16 14.84,11.16 14.84,10.51
PMID on Top Layer: 7.3,16 7.3,15.09 7.35,15.09 7.87,14.57 7.87,12.86 8.15,12.86 8.15,16
SW on Top Layer: 8.25,12.92 17.65,12.92 17.65,16.73 9.87,16.73 8.25,14.62
SW on Bottom Layer: 8.89,16.6 15.11,16.6 15.11,14.57 8.89,14.57
SW2 on Top Layer: 22.02,9.08 21.2,9.08 21.2,5.65 22.21,4.65 24,4.65 24,6.95 22.86,6.95 22.22,7.54 22.02,7.88
SYS on Top Layer: 14.77,10.82 18.16,7.45 18.16,4.24 19.37,4.24 20.64,5.66 20.64,7.52 21.21,8.09 21.21,8.35 20.45,8.35 19.93,8.87 18.59,8.87 17.63,10.08 17.63,10.82
SYS on Top Layer: 9.85,12.93 14.22,12.93 14.48,12.66 17.66,12.66 17.66,10.61 11.86,10.61 10.74,10.22 9.2,10.22 8.73,10.56 8.73,12.09 9.85,12.02
SYS on Top Layer: 18.16,8.87 19.94,8.87 19.94,5.72 18.16,5.72
VOUT on Top Layer: 22.07,9.36 23.24,9.36 24.09,8.5 26.03,8.5 26.03,10.24 26.03,10.25 24.54,10.25 23.37,11.42 23.37,12.79 22.61,12.79 22.61,11.14 22.1,10.63 22.1,9.39

Small or netless copper shapes (teardrops, artwork), in the pictures only: 1 on Inner2

## Text on the board
Bottom Silkscreen Layer: SOLAR CHARGER / V6 | B+ | B- | S- | S+
